# EAGLE design FT232R-perso (EAGLE 5.10)
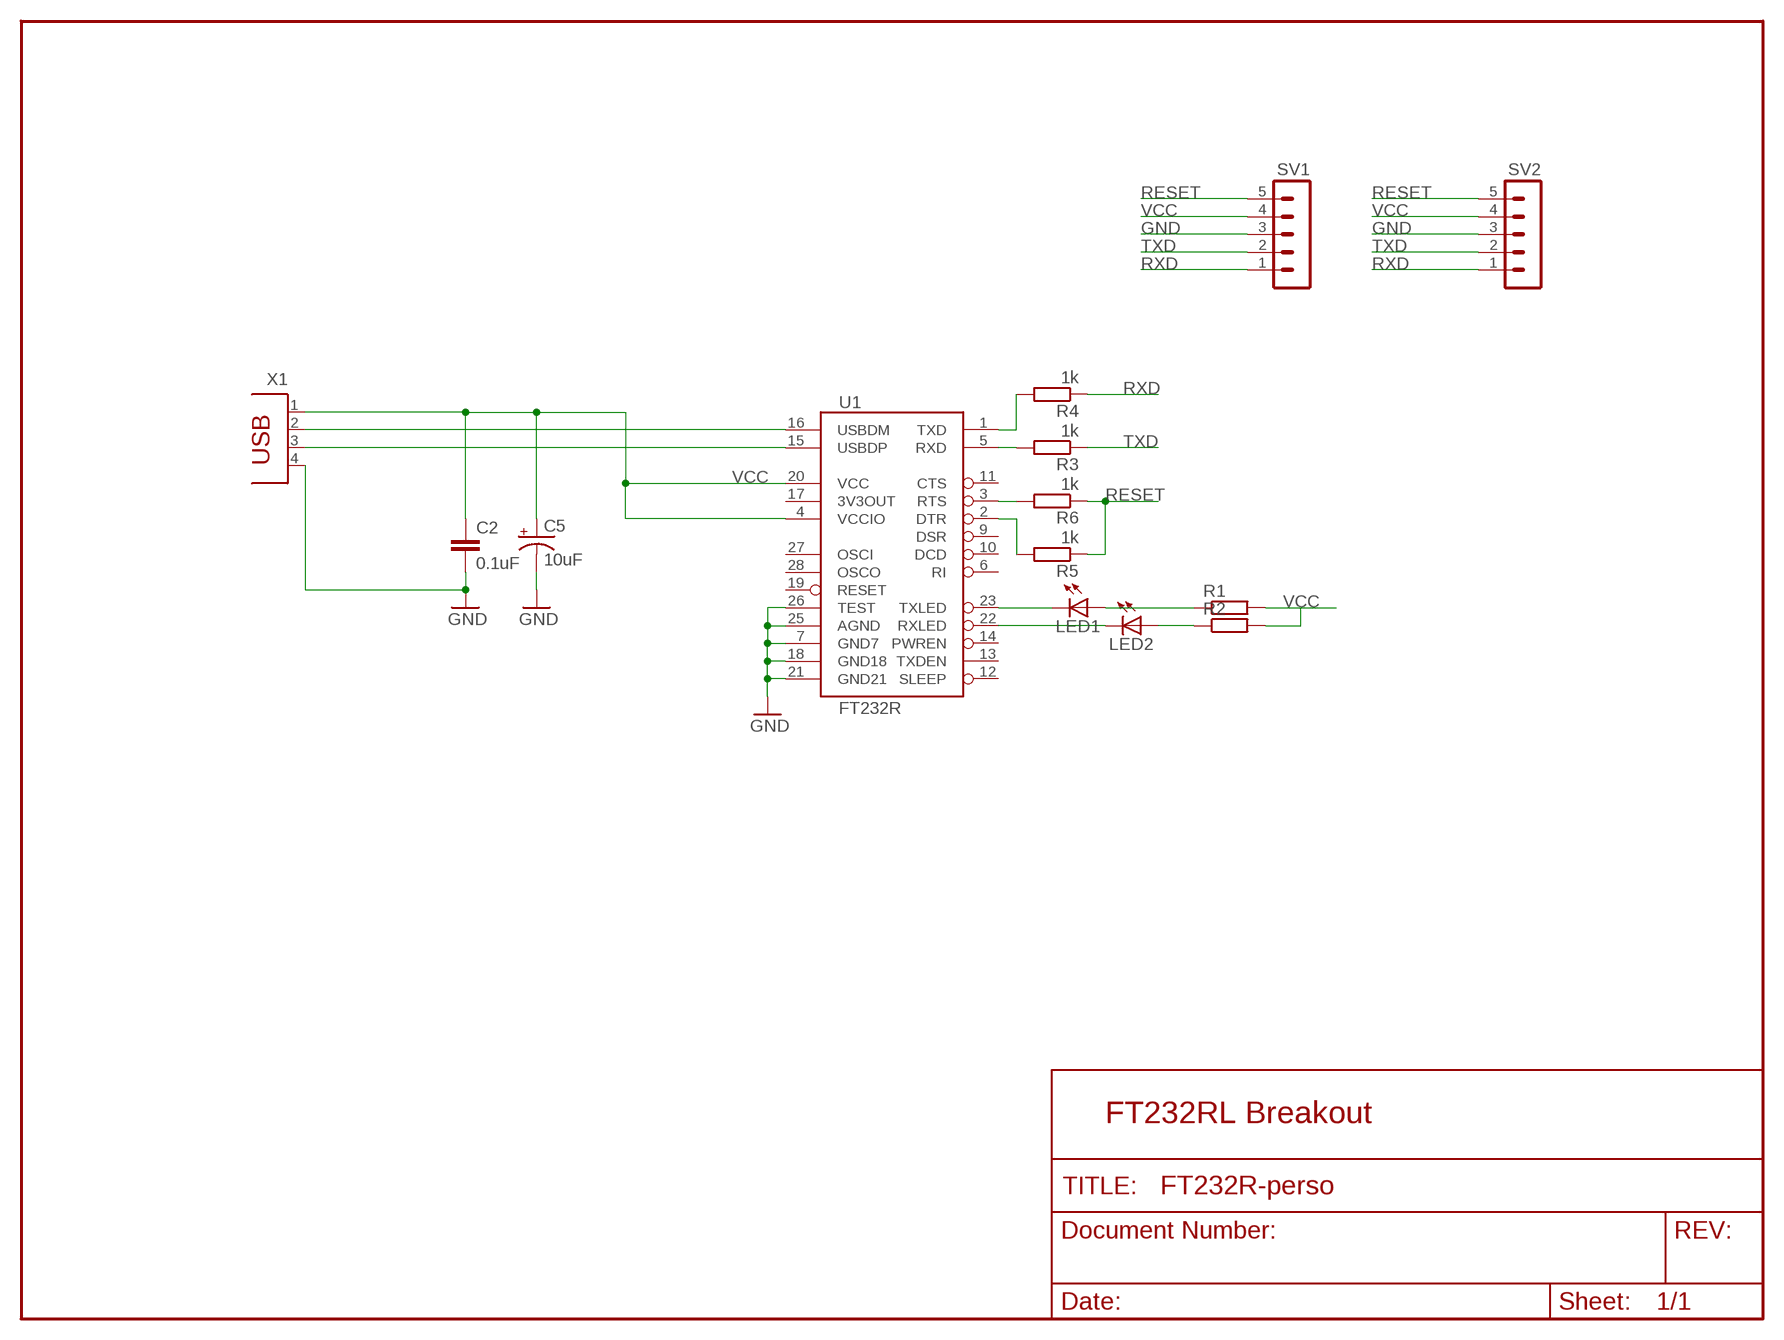
[diagram p0: schematic, sheet 1]

## Parts
C2  0.1uF  CAPPTH2  [CAP-PTH-SMALL2]
C5  10uF  CAP_POLPTH2  [CPOL-RADIAL-10UF-25V]
LED1  LEDCHIP-LED0805  [CHIP-LED0805]
LED2  LEDCHIP-LED0805  [CHIP-LED0805]
R1  R-EU_0207/2V  [0207/2V]
R2  R-EU_0207/2V  [0207/2V]
R3  1k  R-EU_0204/7  [0204/7]
R4  1k  R-EU_0204/7  [0204/7]
R5  1k  R-EU_0204/7  [0204/7]
R6  1k  R-EU_0204/7  [0204/7]
SV1  MA05-1  [MA05-1]
SV2  MA05-1  [MA05-1]
U1  FT232R  FT232RLSSOP  [SSOP28DB]
X1  PN61729  [PN61729]

## Nets
GND [power]: C2.2 C5.2(-) SV1.3 SV2.3 U1.7(GND7) U1.18(GND18) U1.21(GND21) U1.25(AGND) U1.26(TEST) X1.4
N$1: LED1.C U1.23(TXLED)
N$2: LED2.C U1.22(RXLED)
N$3: LED1.A R1.1
N$4: LED2.A R2.1
N$5: R4.2 U1.1(TXD)
N$7: R3.2 U1.5(RXD)
N$8: R5.2 U1.2(DTR)
N$9: R6.2 U1.3(RTS)
RESET: R5.1 R6.1 SV1.5 SV2.5
RXD: R4.1 SV1.1 SV2.1
TXD: R3.1 SV1.2 SV2.2
USB_D+: U1.15(USBDP) X1.3
USB_D-: U1.16(USBDM) X1.2
VCC [power]: C2.1 C5.1(+) R1.2 R2.2 SV1.4 SV2.4 U1.4(VCCIO) U1.20(VCC) X1.1
Unconnected: U1.6(RI) U1.9(DSR) U1.10(DCD) U1.11(CTS) U1.12(SLEEP) U1.13(TXDEN) U1.14(PWREN) U1.17(3V3OUT) U1.19(RESET) U1.27(OSCI) U1.28(OSCO)

## Notes on the sheet
- FT232RL Breakout

## Library data of the parts
C2 = SparkFun:CAP: Capacitor Standard 0603 ceramic capacitor, and 0.1" leaded capacitor.
C5 = SparkFun:CAP_POL: Capacitor Polarized These are standard SMD and PTH capacitors. Normally 10uF, 47uF, and 100uF in electrolytic and tantalum varieties. Always verify the external diameter of the through hole cap, it varies with capacity, voltage, and manufacturer. The EIA devices should be standard.
LED1 LED2 = 0-svo:LED: LED OSRAM: - CHIPLED LG R971, LG N971, LY N971, LG Q971, LY Q971, LO R971, LY R971 LH N974, LH R974 LS Q976, LO Q976, LY Q976 LO Q996 - Hyper CHIPLED LW Q18S LB Q993, LB Q99A, LB R99A - SideLED LS A670, LO A670, LY A670, LG A670, LP A670 LB A673, LV A673, LT A673, LW A673 LH A674 LY A675 LS A676, LA A676, LO A676, LY A676, LW A676 LS A679, LY A679, LG A679 - Hyper Micro SIDELED® LS Y876, LA Y876, LO Y876, LY Y876 LT Y87S - SmartLED LW L88C, LW L88S LB L89C, LB L89S, LG L890 LS L89K, LO L89K, LY L89K LS L896, LA L896, LO L896, LY L896 - TOPLED LS T670, LO T670, LY T670, LG T670, LP T670 LSG T670, LSP T670, LSY T670, LOP T670, LYG T670 LG T671, LOG T671, LSG T671 LB T673, LV T673, LT T673, LW T673 LH T674 LS T676, LA T676, LO T676, LY T676, LB T676, LH T676, LSB T676, LW T676 LB T67C, LV T67C, LT T67C, LS T67K, LO T67K, LY T67K, LW E67C LS E67B, LA E67B, LO E67B, LY E67B, LB E67C, LV E67C, LT E67C LW T67C LS T679, LY T679, LG T679 LS T770, LO T770, LY T770, LG T770, LP T770 LB T773, LV T773, LT T773, LW T773 LH T774 LS E675, LA E675, LY E675, LS T675 LS T776, LA T776, LO T776, LY T776, LB T776 LHGB T686 LT T68C, LB T68C - Hyper Mini TOPLED® LB M676 - Mini TOPLED Santana® LG M470 LS M47K, LO M47K, LY M47K Source: http://www.osram.convergy.de/
R1-R6 = rcl:R-EU_: RESISTOR, European symbol
SV1 SV2 = 0-svo:MA05-1: PIN HEADER
U1 = SparkFun:FT232RL: USB UART FT232RL 4th Generation USB UART (USB <-> Serial) Controller. Spark Fun Electronics SKU : COM-00650
X1 = con-berg:PN61729: BERG USB connector; OC_FARNELL: unknown; OC_NEWARK: unknown

## Net classes
0 default: width 0.203 mm
1 power: width 0.254 mm

## Board
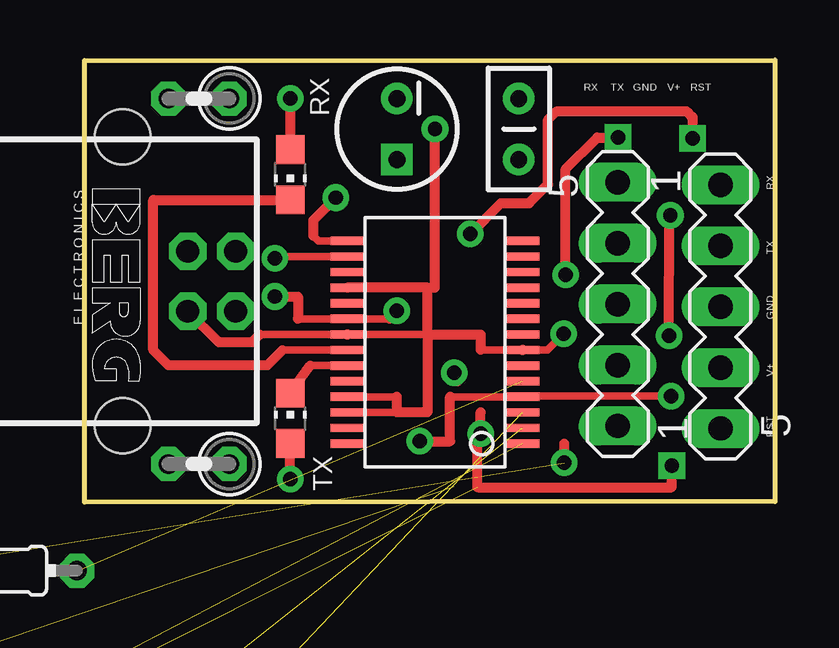
[diagram p1: board, top side]
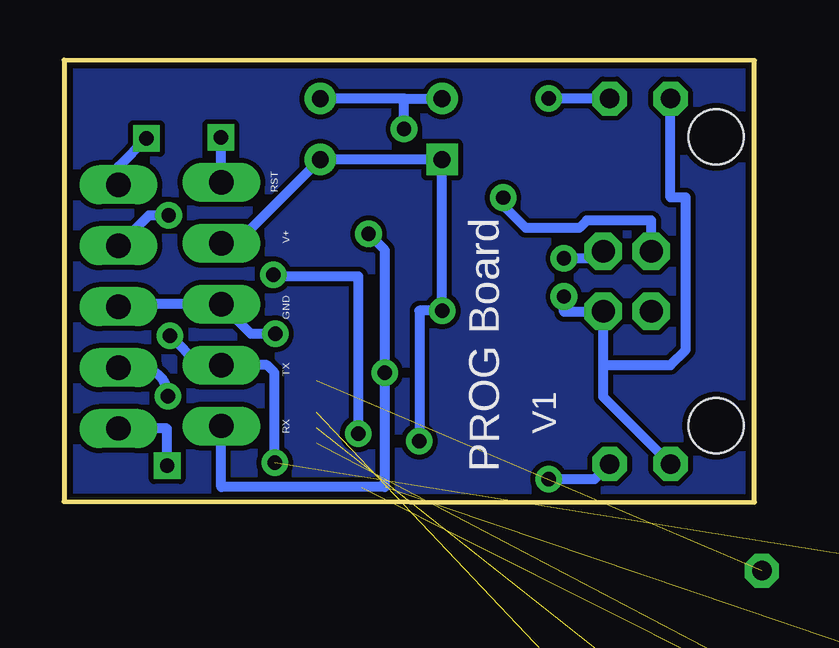
[diagram p2: board, bottom side, seen from below]

Size 28.78 x 18.44 mm. Coordinates in mm from the lower left corner, seen from the top.
Outline: 0,18.41 28.78,18.44 28.78,0.02 0,0 0,18.41
Copper layers (1*16): Top 0.035mm / dielectric 1.5mm / Bottom 0.035mm
Design rules "SparkFun": minimum track width 8mil, minimum drill 20mil, track to track 8mil, track to pad 8mil, pad to pad 8mil, via to via 8mil, smd to smd 8mil, copper to edge 10mil, drill to drill 8mil, minimum pad ring 12mil, minimum via ring 10mil, stop-mask expansion 4mil, vias tented up to drill 25mil, thermal gap 10mil

### Footprints (pad centres in the part's own frame; a part is rotated, then mirrored left to right if it is on the bottom)
CAP-PTH-SMALL2 = drill 0.7 round: 1 0,0; 2 2.54,0
CPOL-RADIAL-10UF-25V = drill 0.7 square: 1 1.27,0 | drill 0.7 round: 2 -1.27,0
CHIP-LED0805 = smd 1.2 x 1.2: A 0,-1.05; C 0,1.05
0207/2V = drill 0.813 octagon: 1 -1.27,0; 2 1.27,0
0204/7 = drill 0.813 octagon: 1 -3.81,0; 2 3.81,0
MA05-1 = drill 1.016 long: 1 -5.08,0; 2 -2.54,0; 3 0,0; 4 2.54,0; 5 5.08,0
SSOP28DB = smd 0.348 x 1.397: 1 -4.225,-3.656; 2 -3.575,-3.656; 3 -2.925,-3.656; 4 -2.275,-3.656; 5 -1.625,-3.656; 6 -0.975,-3.656; 7 -0.325,-3.656; 8 0.325,-3.656; 9 0.975,-3.656; 10 1.625,-3.656; 11 2.275,-3.656; 12 2.925,-3.656; 13 3.575,-3.656; 14 4.225,-3.656; 15 4.225,3.656; 16 3.575,3.656; 17 2.925,3.656; 18 2.275,3.656; 19 1.625,3.656; 20 0.975,3.656; 21 0.325,3.656; 22 -0.325,3.656; 23 -0.975,3.656; 24 -1.625,3.656; 25 -2.275,3.656; 26 -2.925,3.656; 27 -3.575,3.656; 28 -4.225,3.656
PN61729 = drill 0.95 octagon: 1 1.25,4.71; 2 -1.25,4.71; 3 -1.25,2.71; 4 1.25,2.71 | hole 2.3: -6.02,0; 6.02,0

### Placement (x,y rotation side)
C2  18.1,14.29 90 top
C5  13.02,15.56 270 top
LED1  8.57,3.49 0 top
LED2  8.57,13.65 180 top
R1  4.76,1.59 180 top
R2  4.76,16.83 180 top
R3  -4.13,-2.86 0 top
R4  -4.13,-7.3 0 top  (outside the outline)
R5  -4.13,-11.59 0 top  (outside the outline)
R6  -4.13,-15.88 0 top  (outside the outline)
SV1  22.23,8.26 90 top
SV2  26.51,8.15 270 top
U1  14.61,6.67 90 top
X1  1.59,9.21 270 top

### Tracks (layer width: path | path; a pad name or v marks a point on that pad's centre or on a via)
GND  (via drill 0.6)
  Top 0.305: U1.21 14.29,6.99 | 16.51,6.35 U1.7 | 13.02,3.74 U1.26 | 13.02,4.39 U1.25 | 7.3,6.98 U1.21 | v19.97,7.01 19.3,6.34 U1.7
  Top 0.406: X1.4 5.59,6.67 6.98,6.67 7.3,6.98 | 14.29,6.98 16.51,6.98 16.51,6.35 | U1.7 | 14.29,6.98 14.29,6.99 14.29,8.94 | 14.29,6.98 14.29,3.74 13.02,3.74 13.02,4.39 | U1.21 | 14.29,8.94 U1.18 | 14.29,8.94 14.6,8.94 v14.6,15.56
  Bottom 0.406: 14.6,16.83 C5.2 | 14.6,16.83 C2.2 | v14.6,15.56 14.6,16.83 | SV2.3 26.41,8.26 SV1.3 20.98,7.01 v19.97,7.01
N$1
  Top 0.305: 9.41,5.69 U1.23
  Top 0.406: LED1.C 9.41,5.69
N$2
  Top 0.305: 8.25,6.34 U1.22
  Top 0.406: 8.25,6.34 7.62,5.71 3.48,5.71 2.86,6.34 2.86,12.6 LED2.C
N$3  (via drill 0.6)
  Top 0.406: v8.57,0.95 LED1.A
  Bottom 0.406: R1.1 6.67,0.95 v8.57,0.95
N$4  (via drill 0.6)
  Top 0.406: v8.57,16.83 LED2.A
  Bottom 0.406: R2.1 v8.57,16.83
N$5  (1 unrouted)
N$6
  pour Bottom: 0,18.41 28.73,18.41 28.73,0 0,0
N$7  (1 unrouted)
N$8  (1 unrouted)
N$9  (1 unrouted)
RESET  (via drill 0.6)  (2 unrouted)
  Top 0.406: v16.51,2.86 16.51,3.09 | v16.51,2.86 16.51,3.74 | v24.48,1.52 24.48,0.62 16.37,0.62 16.37,2.86 v16.51,2.86 | v22.24,15.2 21.38,15.2 20.05,13.88 v20.05,9.48
  Bottom 0.406: v16.51,2.86 16.51,9.41 19.99,9.41 v20.05,9.48 | SV2.5 24.48,3.07 v24.48,1.52 | SV1.5 22.24,13.35 v22.24,15.2
RXD  (via drill 0.6)  (1 unrouted)
  Top 0.406: v15.41,5.4 15.56,5.04 | v16.08,11.19 17.36,12.46 18.52,12.46 19.32,13.25 19.32,15.94 19.68,16.3 25.1,16.3 25.35,16.06 v25.35,15.16
  Bottom 0.406: SV1.1 22.23,0.64 15.41,0.64 v15.41,5.4 15.41,10.51 v16.08,11.19 | v25.35,15.16 26.51,14 SV2.1
TXD  (via drill 0.6)  (1 unrouted)
  Top 0.406: v20,1.64 20,2.44 | v24.42,11.96 24.38,11.92 v24.36,6.94
  Bottom 0.406: v20,1.64 20,5.4 20.32,5.71 SV1.2 23.14,5.71 v24.36,6.94 | SV2.2 25.25,11.96 v24.42,11.96
USB_D+  (via drill 0.6)
  Top 0.305: 9.53,11.11 9.75,10.89 U1.15
  Top 0.406: v10.48,12.7 9.53,11.75 9.53,11.11
  Bottom 0.406: X1.3 4.3,11.75 6.98,11.75 7.3,11.43 9.53,11.43 10.48,12.38 v10.48,12.7
USB_D-  (via drill 0.6)
  Top 0.305: 7.94,10.24 U1.16
  Top 0.406: v7.94,10.16 7.94,10.24
  Bottom 0.406: X1.2 6.3,10.16 v7.94,10.16
VCC  (via drill 0.6)
  Top 0.254: U1.4 arc-90 18.29,4.42
  Top 0.305: 8.89,7.64 U1.20 12.72,7.64 | 15.24,4.39 U1.4 | 18.29,4.42 v24.45,4.42
  Top 0.406: v7.94,8.57 8.89,8.57 8.89,7.64 | 12.72,7.64 v13.01,7.98 | v13.97,2.54 15.24,2.54 15.24,4.39
  Bottom 0.406: 6.3,5.71 6.3,4.39 R1.2 | 6.3,5.71 X1.1 6.3,7.94 7.94,7.94 v7.94,8.57 | R2.2 3.49,12.7 2.86,12.7 2.86,6.35 3.49,5.71 6.3,5.71 | SV1.4 21.59,10.79 C2.1 C5.1 v13.01,7.98 13.97,7.98 v13.97,2.54 | SV2.4 25.64,5.61 arc90 v24.45,4.42

### Text on the board
tNames: RX | TX | GND | V+ | RST | RX | RX | TX | GND | V+ | RST | TX
bNames: RST | V+ | GND | TX | V1 | RX | PROG Board